# Altium schematic sheet AZ_elec2.SchDoc
size A
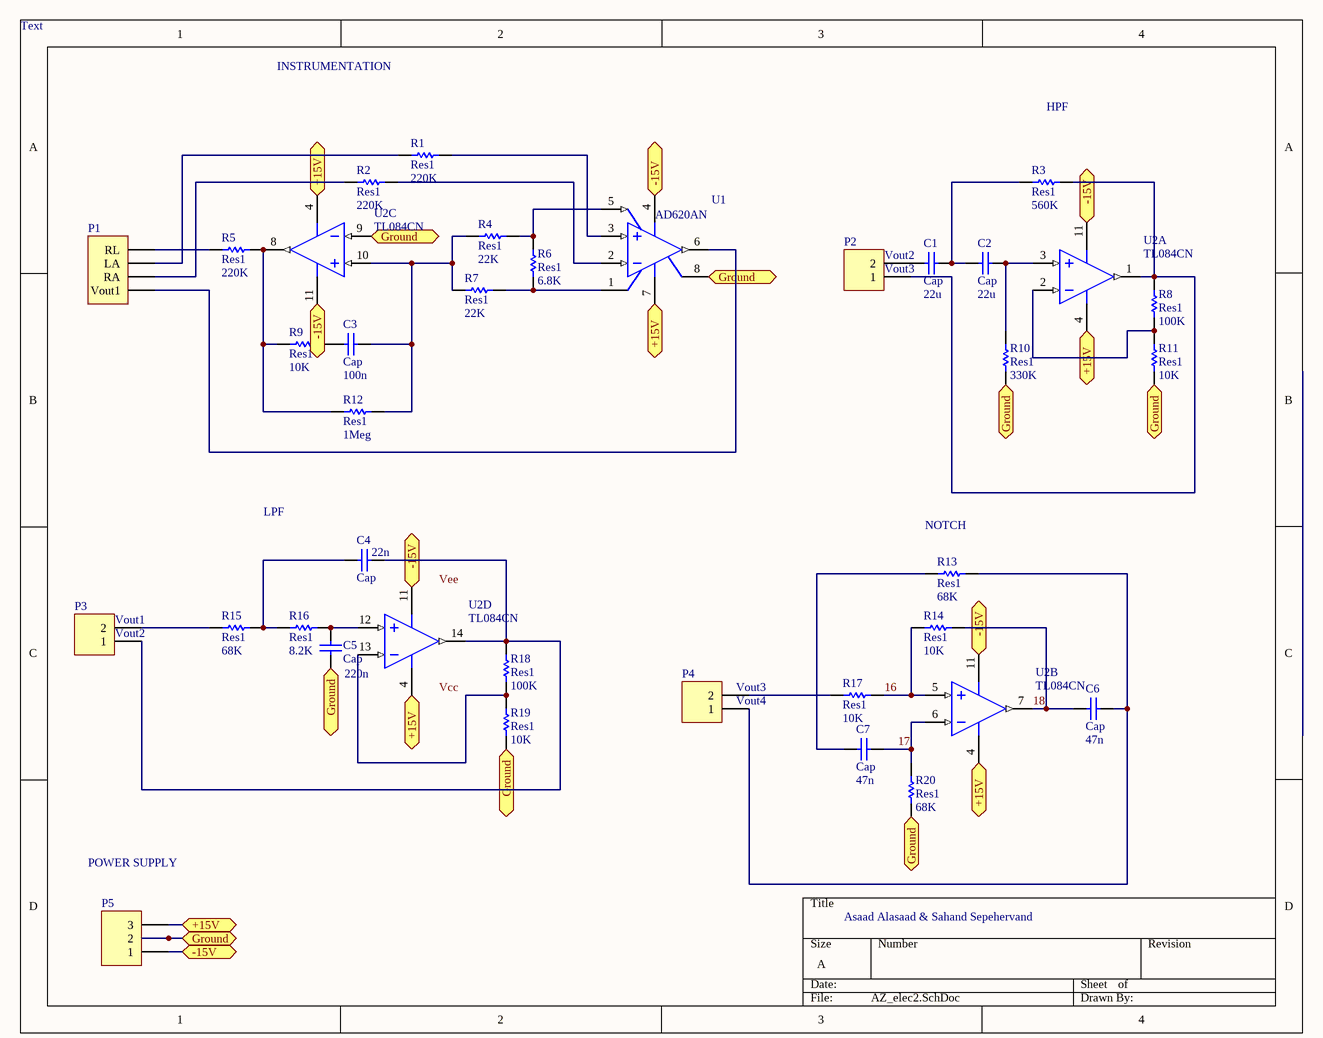
[diagram p0: AZ_elec2.SchDoc]

## Parts
C1  Cap  value 22u  [AXIAL-0.5]
C2  Cap  value 22u  [AXIAL-0.5]
C3  Cap  value 100n  [AXIAL-0.5]
C4  Cap  value 22n  [AXIAL-0.5]
C5  Cap  value 220n  [AXIAL-0.5]
C6  Cap  value 47n  [AXIAL-0.5]
C7  Cap  value 47n  [AXIAL-0.5]
P1  (no value)  [HDR1X4H]
P2  (no value)  [HDR1X2H]
P3  (no value)  [HDR1X2H]
P4  (no value)  [HDR1X2H]
P5  (no value)  [HDR1X3H]
R1  Res1  value 220K  [AXIAL-0.3]
R2  Res1  value 220K  [AXIAL-0.3]
R3  Res1  value 560K  [AXIAL-0.3]
R4  Res1  value 22K  [AXIAL-0.3]
R5  Res1  value 220K  [AXIAL-0.3]
R6  Res1  value 6.8K  [AXIAL-0.3]
R7  Res1  value 22K  [AXIAL-0.3]
R8  Res1  value 100K  [AXIAL-0.3]
R9  Res1  value 10K  [AXIAL-0.3]
R10  Res1  value 330K  [AXIAL-0.3]
R11  Res1  value 10K  [AXIAL-0.3]
R12  Res1  value 1Meg  [AXIAL-0.3]
R13  Res1  value 68K  [AXIAL-0.3]
R14  Res1  value 10K  [AXIAL-0.3]
R15  Res1  value 68K  [AXIAL-0.3]
R16  Res1  value 8.2K  [AXIAL-0.3]
R17  Res1  value 10K  [AXIAL-0.3]
R18  Res1  value 100K  [AXIAL-0.3]
R19  Res1  value 10K  [AXIAL-0.3]
R20  Res1  value 68K  [AXIAL-0.3]
U1  AD620AN  [N-8]
U2  TL084CN  [TI-N14]  (parts A,B,C,D of 4)

## Ports
+15V, -15V, Ground

## Nets
16: R14.1 R17.2 U2.5(IN2+)
17: C7.2 R20.2 U2.6(IN2-)
18: C6.1 R14.2 U2.7(OUT2)
+15V: P5.3 U1.7(V+) U2.4(VCC+) ; port +15V
-15V: P5.1 U1.4(V-) U2.11(VCC-) ; port -15V
Ground: C5.1 P5.2 R10.1 R11.1 R19.1 R20.1 U1.8(RG) U2.9(IN3-) ; port Ground
NetC1_1: C1.1 P2.2
NetC1_2: C1.2 C2.1 R3.1
NetC2_2: C2.2 R10.2 U2.3(IN1+)
NetC3_1: C3.1 R9.2
NetC3_2: C3.2 R4.1 R7.1 R12.2 U2.10(IN3+)
NetC4_1: C4.1 R15.2 R16.1
NetC4_2: C4.2 P3.1 R18.2 U2.14(OUT4)
NetC5_2: C5.2 R16.2 U2.12(IN4+)
NetC6_2: C6.2 P4.1 R13.2
NetC7_1: C7.1 R13.1
NetP1_1: P1.1(Vout1) U1.6(OUT)
NetP1_2: P1.2(RA) R2.1
NetP1_3: P1.3(LA) R1.1
NetP1_4: P1.4(RL) R5.1
NetP2_1: P2.1 R3.2 R8.2 U2.1(OUT1)
NetP3_2: P3.2 R15.1
NetP4_2: P4.2 R17.1
NetR1_2: R1.2 U1.3(+IN)
NetR2_2: R2.2 U1.2(-IN)
NetR4_2: R4.2 R6.2 U1.5(REF)
NetR5_2: R5.2 R9.1 R12.1 U2.8(OUT3)
NetR6_1: R6.1 R7.2 U1.1(RG)
NetR8_1: R8.1 R11.2 U2.2(IN1-)
NetR18_1: R18.1 R19.2 U2.13(IN4-)

## Notes on the sheet
- Text
- INSTRUMENTATION
- HPF
- (near P2) Vout2
- (near P2) Vout3
- LPF
- (near R13) NOTCH
- (near P3) Vout1
- (near P3) Vout2
- (near P4) Vout3
- (near P4) Vout4
- POWER SUPPLY
- Asaad Alasaad & Sahand Sepehervand
- Labels drawn without touching a wire or pin: Vcc, Vee

## Library data of the parts
C1-C7 = Cap: Capacitor; Published: 8-Jun-2000; LatestRevisionDate: 17-Jul-2002; LatestRevisionNote: Re-released for DXP Platform.; PackageReference: RAD-0.3; Publisher: Altium Limited; PackageDescription: Radial Cap, Thru-Hole; 2 Leads; 0.3 in Pin Spacing
P1 = Header 4H: Header, 4-Pin, Right Angle; LatestRevisionDate: 17-Jul-2002; LatestRevisionNote: Re-released for DXP Platform.; Publisher: Altium Limited
P2-P4 = Header 2H: Header, 2-Pin, Right Angle; LatestRevisionDate: 17-Jul-2002; LatestRevisionNote: Re-released for DXP Platform.; Publisher: Altium Limited
P5 = Header 3H: Header, 3-Pin, Right Angle; LatestRevisionDate: 17-Jul-2002; LatestRevisionNote: Re-released for DXP Platform.; Publisher: Altium Limited
R1-R20 = Res1: Resistor; Published: 8-Jun-2000; LatestRevisionDate: 17-Jul-2002; LatestRevisionNote: Re-released for DXP Platform.; PackageReference: AXIAL-0.3; Publisher: Altium Limited; PackageDescription: Axial Device, Thru-Hole; 2 Leads; 0.3 in Pin Spacing
U1 = AD620AN: Low-Cost, Low-Power Instrumentation Amplifier; Published: 8-Jun-2000; LatestRevisionDate: 04-Mar-2005; LatestRevisionNote: Stylized 3D Model Added.; DatasheetVersion: REV.D 1998; PackageVersion: revA; PackageReference: N-8; Publisher: Altium Limited; PackageDescription: DIP; 8 Leads; Row Spacing 7.62 mm; Pitch 2.54 mm; ComponentLink1Description: Manufacturer Link; ComponentLink1URL: http://www.analog.com/en/prod/0%2C2877%2CAD620%2C00.html; ComponentLink2Description: Datasheet; ComponentLink2URL: http://www.analog.com/UploadedFiles/Data_Sheets/897653854AD620_g.pdf
U2 = TL084CN: JFET-Input Operational Amplifier, 7 to 36 V, 0 to 70 degC, 14-pin DIP (N14), Pb-Free (RoHS); Manufacturer: Texas Instruments; CMRR(Min)(dB): 70; GBW(Typ)(MHz): 3; IIB(Max)(pA): 400; Iq per channel(Max)(mA): 2.8; Number of Channels: 4; Offset Drift(Typ)(uV/C): 18; Rating: Catalog; Slew Rate(Typ)(V/us): 13; Sub Family: General Purpose Amplifier, High Supply Voltage Amplifier (>=30V); Total Supply Voltage(Max)(+5V is 5, +/-5V is 10): 36; Total Supply Voltage(Min)(+5V is 5, +/-5V is 10): 7; Vio (25C)(Max)(mV): 15; DatasheetVersion: SLOS081G; PackageVersion: 4040049/E, 12/2002; PackageReference: N14; PackageDescription: 14-Pin Plastic In-Line, Body 19.305 x 6.35 mm, Pitch 2.54 mm; Supplier 1: Digi-Key; Supplier Part Number 1: 296-1784-5-ND; Supplier 2: Farnell; Supplier Part Number 2: 1106020; Supplier 3: Newark; Supplier Part Number 3: 08F9374; Supplier 4: Mouser; Supplier Part Number 4: 595-TL084CN; Eco-Plan: Pb-Free (RoHS); Vn at 1kHz(Typ)(nV/rtHz): 18; Mounting Technology: Through Hole; Code_JEDEC: MS-001; PartNumber: TL084CN; ComponentLink1Description: Manufacturer URL; ComponentLink1URL: http://www.ti.com/; ComponentLink2Description: Datasheet; ComponentLink2URL: http://www.ti.com/lit/ds/symlink/tl084.pdf; ComponentLink3Description: Package Specification; ComponentLink3URL: http://www.ti.com/lit/ml/mpdi002c/mpdi002c.pdf